# EAGLE design MCP960XL-L0X-RL0X_EVM_v1_Eagle_7.x (EAGLE 7.7.0)
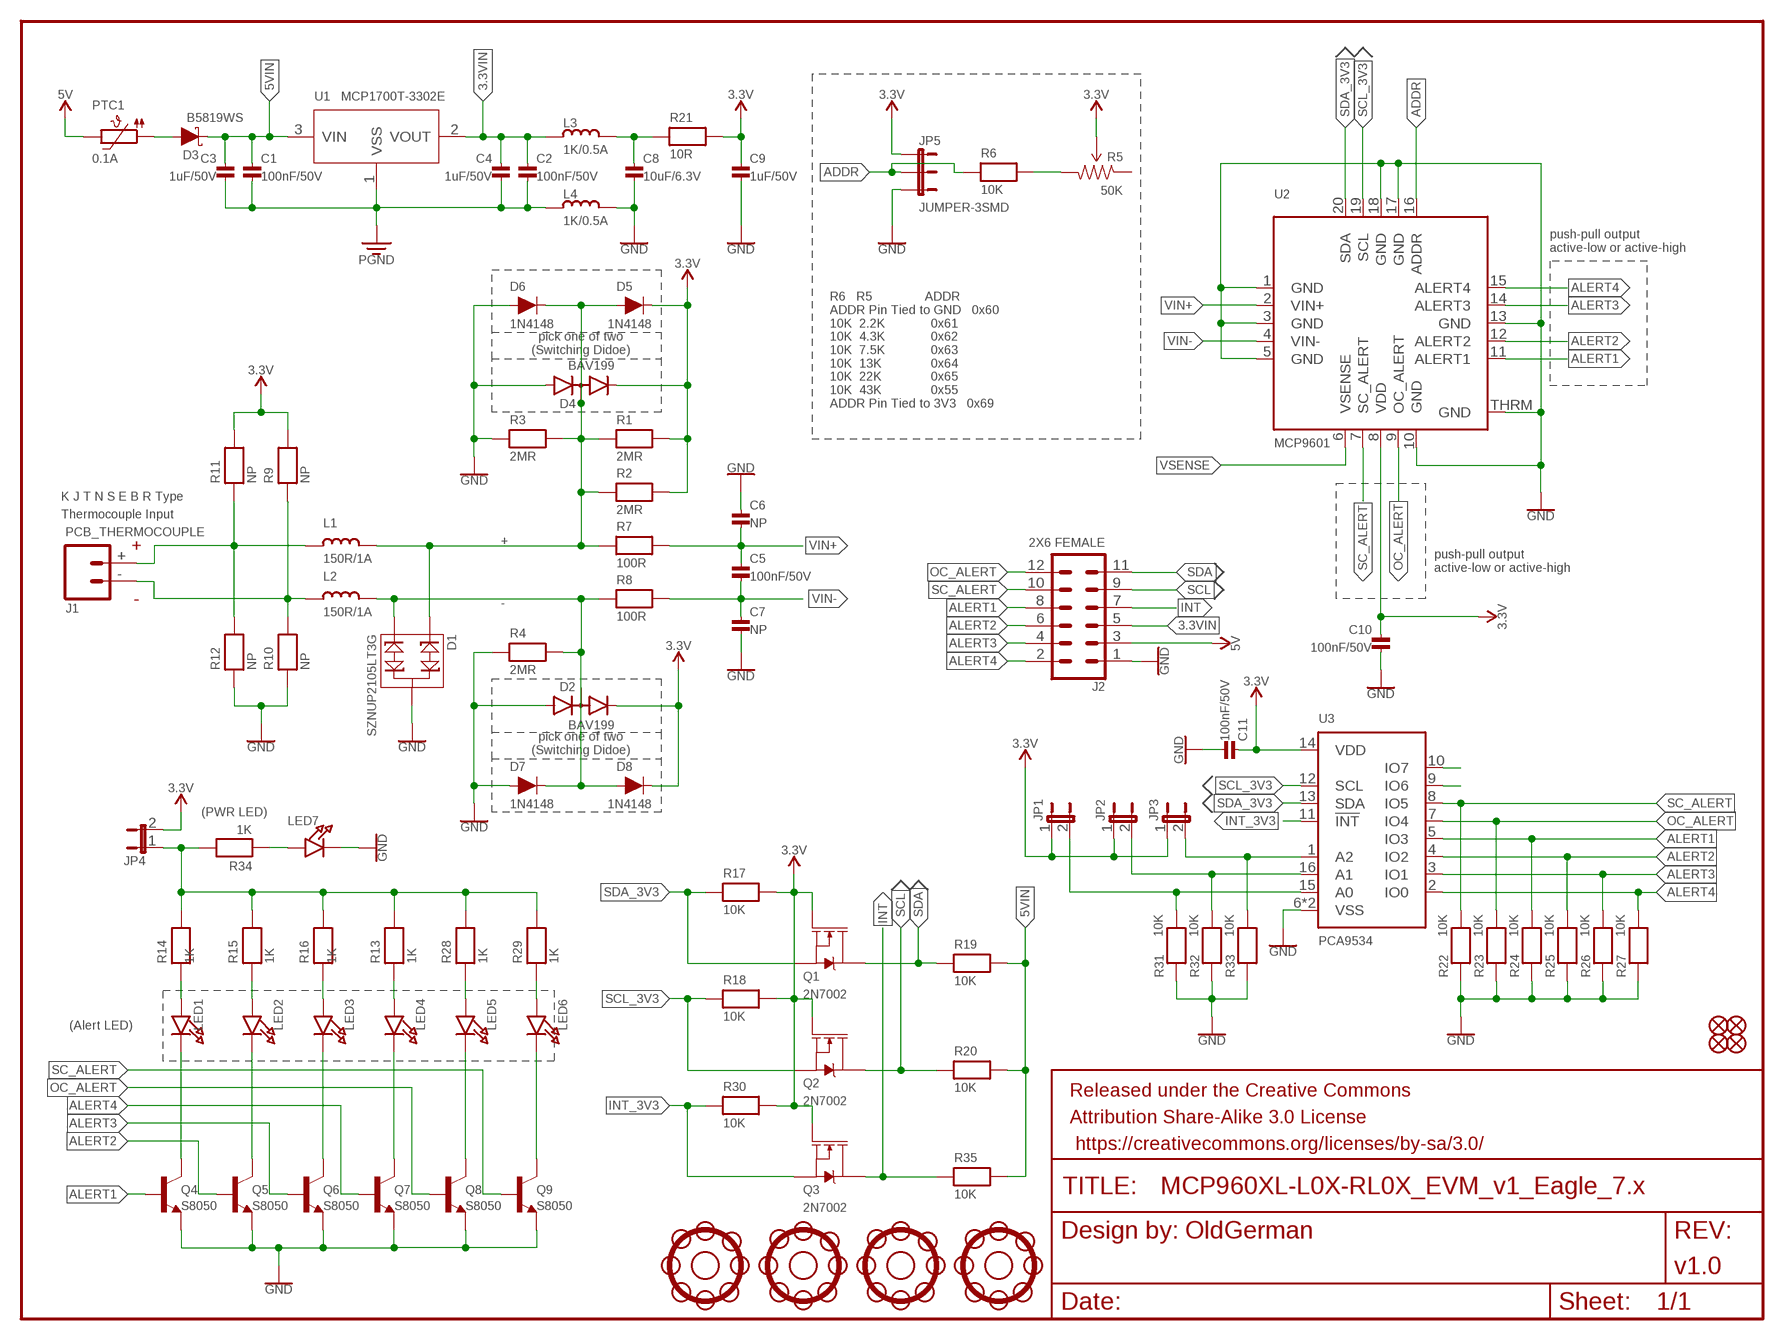
[diagram p0: schematic, sheet 1]

## Parts
C1  100nF/50V  CAP_CERAMIC0603  [0603]
C2  100nF/50V  CAP_CERAMIC0603  [0603]
C3  1uF/50V  CAP_CERAMIC0603  [0603]
C4  1uF/50V  CAP_CERAMIC0603  [0603]
C5  100nF/50V  CAP_CERAMIC0603  [0603]
C6  NP  CAP_CERAMIC0603  [0603]
C7  NP  CAP_CERAMIC0603  [0603]
C8  10uF/6.3V  CAP_CERAMIC0603  [0603]
C9  1uF/50V  CAP_CERAMIC0603  [0603]
C10  100nF/50V  CAP_CERAMIC0603  [0603]
C11  100nF/50V  CAP_CERAMIC0603  [0603]
D1  SZNUP2105LT3G  [SOT23-3]
D2  BAV199  [SOT23-3]
D3  B5819WS  DIODE_SCHOTTKYSOD323  [SOD-323]
D4  BAV199  [SOT23-3]
D5  1N4148  DIODE  [SOD-323]
D6  1N4148  DIODE  [SOD-323]
D7  1N4148  DIODE  [SOD-323]
D8  1N4148  DIODE  [SOD-323]
FID1  FIDUCIAL1X2.5  [FIDUCIAL-1X2.5]
FID2  FIDUCIAL1X2.5  [FIDUCIAL-1X2.5]
FID3  FIDUCIAL1X2.5  [FIDUCIAL-1X2.5]
FID4  FIDUCIAL1X2.5  [FIDUCIAL-1X2.5]
FRAME1  FRAME-LETTER  [CREATIVE_COMMONS]
J1  PCB_THERMOCOUPLE  [PCC-SMP]
J2  2X6 FEMALE  CONN_06X2PTH_FEMALE  [2X6]
JP1  JUMPER-2SMD-NC  [SJ_2S]
JP2  JUMPER-2SMD-NC  [SJ_2S]
JP3  JUMPER-2SMD-NC  [SJ_2S]
JP4  JUMPER-2SMD-NC  [SJ_2S]
JP5  JUMPER-3SMD  [SJ_3]
L1  150R/1A  INDUCTOR0603  [0603]
L2  150R/1A  INDUCTOR0603  [0603]
L3  1K/0.5A  INDUCTOR0603  [0603]
L4  1K/0.5A  INDUCTOR0603  [0603]
LED1  LED0603  [CHIPLED_0603]
LED2  LED0603  [CHIPLED_0603]
LED3  LED0603  [CHIPLED_0603]
LED4  LED0603  [CHIPLED_0603]
LED5  LED0603  [CHIPLED_0603]
LED6  LED0603  [CHIPLED_0603]
LED7  LED0603  [CHIPLED_0603]
PTC1  0.1A  PTC1206  [1206]
Q1  2N7002  MOSFET-NCH-AO3404A  [SOT23-3]
Q2  2N7002  MOSFET-NCH-AO3404A  [SOT23-3]
Q3  2N7002  MOSFET-NCH-AO3404A  [SOT23-3]
Q4  S8050  TRANS_NPN-MMBT2222AL  [SOT23-3]
Q5  S8050  TRANS_NPN-MMBT2222AL  [SOT23-3]
Q6  S8050  TRANS_NPN-MMBT2222AL  [SOT23-3]
Q7  S8050  TRANS_NPN-MMBT2222AL  [SOT23-3]
Q8  S8050  TRANS_NPN-MMBT2222AL  [SOT23-3]
Q9  S8050  TRANS_NPN-MMBT2222AL  [SOT23-3]
R1  2MR  RESISTOR0603  [0603]
R2  2MR  RESISTOR0603  [0603]
R3  2MR  RESISTOR0603  [0603]
R4  2MR  RESISTOR0603  [0603]
R5  50K  POT-SMD  [TRIMPOT-3MM]
R6  10K  RESISTOR0603  [0603]
R7  100R  RESISTOR0603  [0603]
R8  100R  RESISTOR0603  [0603]
R9  NP  RESISTOR0603  [0603]
R10  NP  RESISTOR0603  [0603]
R11  NP  RESISTOR0603  [0603]
R12  NP  RESISTOR0603  [0603]
R13  1K  RESISTOR0603  [0603]
R14  1K  RESISTOR0603  [0603]
R15  1K  RESISTOR0603  [0603]
R16  1K  RESISTOR0603  [0603]
R17  10K  RESISTOR0603  [0603]
R18  10K  RESISTOR0603  [0603]
R19  10K  RESISTOR0603  [0603]
R20  10K  RESISTOR0603  [0603]
R21  10R  RESISTOR0603  [0603]
R22  10K  RESISTOR0603  [0603]
R23  10K  RESISTOR0603  [0603]
R24  10K  RESISTOR0603  [0603]
R25  10K  RESISTOR0603  [0603]
R26  10K  RESISTOR0603  [0603]
R27  10K  RESISTOR0603  [0603]
R28  1K  RESISTOR0603  [0603]
R29  1K  RESISTOR0603  [0603]
R30  10K  RESISTOR0603  [0603]
R31  10K  RESISTOR0603  [0603]
R32  10K  RESISTOR0603  [0603]
R33  10K  RESISTOR0603  [0603]
R34  1K  RESISTOR0603  [0603]
R35  10K  RESISTOR0603  [0603]
U1  MCP1700T-3302E  LDO_3PIN  [SOT23-3]
U2  MCP9601  [VQFN20_5MM]
U3  PCA9534  [HVQFN16_4X4_0.65MM]
U$1  SUN_HOLE_M3  [SUN_HOLE_M3]
U$3  SUN_HOLE_M3  [SUN_HOLE_M3]
U$4  SUN_HOLE_M3  [SUN_HOLE_M3]
U$6  SUN_HOLE_M3  [SUN_HOLE_M3]

## Nets
3.3V: C9.1 C10.1 C11.1 D2.3(C) D4.3(C) D5.C D8.C JP1.1 JP2.1 JP3.1 JP4.2 JP5.1 Q1.1(G) Q2.1(G) Q3.1(G) R1.2 R2.2 R5.2(WIPER) R9.2 R11.2 R17.2 R18.2 R21.2 R30.2 U2.8(VDD) U3.14(VDD)
3.3VIN: C2.1 C4.1 J2.5 L3.1 U1.2(VOUT)
5V: J2.3 PTC1.2
5VIN: C1.1 C3.1 D3.C R19.2 R20.2 R35.2 U1.3(VIN)
A0: JP1.2 R31.2 U3.15(A0)
A1: JP2.2 R32.2 U3.16(A1)
A2: JP3.2 R33.2 U3.1(A2)
ADDR: JP5.2 R6.1 U2.16(ADDR)
ALERT1: J2.8 Q4.1(B) R24.2 U2.11(ALERT1) U3.5(IO3)
ALERT2: J2.6 Q5.1(B) R25.2 U2.12(ALERT2) U3.4(IO2)
ALERT3: J2.4 Q6.1(B) R26.2 U2.14(ALERT3) U3.3(IO1)
ALERT4: J2.2 Q7.1(B) R27.2 U2.15(ALERT4) U3.2(IO0)
GND: C6.1 C7.2 C8.2 C9.2 C10.2 C11.2 D1.3 D2.1(A) D4.1(A) D6.A D7.A J2.1 JP5.3 L4.2 LED7.C Q4.2(E) Q5.2(E) Q6.2(E) Q7.2(E) Q8.2(E) Q9.2(E) R3.1 R4.1 R10.1 R12.1 R22.1 R23.1 R24.1 R25.1 R26.1 R27.1 R31.1 R32.1 R33.1 U2.1(GND) U2.3(GND) U2.5(GND) U2.10(GND) U2.13(GND) U2.17(GND) U2.18(GND) U2.THRM(GND) U3.6(VSS) U3.PAD(VSS)
INT: J2.7 Q3.3(D) R35.1
INT_3V3: Q3.2(S) R30.1 U3.11(!INT)
L1_OUT: D1.1 D4.2(AC) D5.A D6.C L1.2 R1.1 R2.1 R3.2 R7.1
L2_OUT: D1.2 D2.2(AC) D7.C D8.A L2.2 R4.2 R8.1
N$1: R5.1(CW) R6.2
N$2: C8.1 L3.2 R21.1
N$3: LED4.C Q7.3(C)
N$4: LED4.A R13.1
N$5: LED7.A R34.1
N$6: LED5.C Q8.3(C)
N$7: LED1.C Q4.3(C)
N$8: LED5.A R28.1
N$9: LED6.C Q9.3(C)
N$10: LED1.A R14.1
N$14: LED2.C Q5.3(C)
N$15: LED2.A R15.1
N$16: LED3.C Q6.3(C)
N$17: LED3.A R16.1
N$18: LED6.A R29.1
N$19: D3.A PTC1.1
N$20: U3.10(IO7)
N$21: U3.9(IO6)
N$25: JP4.1 R13.2 R14.2 R15.2 R16.2 R28.2 R29.2 R34.2
OC_ALERT: J2.12 Q8.1(B) R23.2 U2.9(OC_ALERT) U3.7(IO4)
PGND: C1.2 C2.2 C3.2 C4.2 L4.1 U1.1(VSS)
SC_ALERT: J2.10 Q9.1(B) R22.2 U2.7(SC_ALERT) U3.8(IO5)
SCL: J2.9 Q2.3(D) R20.1
SCL_3V3: Q2.2(S) R18.1 U2.19(SCL) U3.12(SCL)
SDA: J2.11 Q1.3(D) R19.1
SDA_3V3: Q1.2(S) R17.1 U2.20(SDA) U3.13(SDA)
TH+: J1.+ L1.1 R11.1 R12.2
TH-: J1.- L2.1 R9.1 R10.2
VIN+: C5.1 C6.2 R7.2 U2.2(VIN+)
VIN-: C5.2 C7.1 R8.2 U2.4(VIN-)
VSENSE: U2.6(VSENSE)
Unconnected: J1.CLIP1 J1.CLIP2 R5.3(CCW)

## Notes on the sheet
- push-pull output
  active-low or active-high
- pick one of two
  (Switching Didoe)
- R6   R5               ADDR
  ADDR Pin Tied to GND   0x60
  10K  2.2K             0x61
  10K  4.3K             0x62
  10K  7.5K             0x63
  10K  13K              0x64
  10K  22K              0x65
  10K  43K              0x55
  ADDR Pin Tied to 3V3   0x69
- K J T N S E B R Type
- Thermocouple Input
- +
- push-pull output
  active-low or active-high
- -
- pick one of two
  (Switching Didoe)
- (PWR LED)
- (Alert LED)
- OldGerman
- v1.0

## Library data of the parts
C1-C11 = microbuilder:CAP_CERAMIC: Ceramic Capacitors 0402 - 0402 Surface Mount Capacitors 16pF 50V 5% [Digikey: 445-4899-2-ND] 18pF 50V 5% [Digikey: 490-1281-2-ND] 22pF 50V 5% [Digikey: 490-1283-2-ND] 68pF 50V 5% [Digikey: 490-1289-2-ND] 0.1uF 10V 10% [Digikey: 490-1318-2-ND] 1.0uF 6.3V 10% [Digikey: 490-1320-2-ND] 0603 - 0603 Surface Mount Capacitors 16 pF 50V 5% [Digikey: 445-5051-2-ND] 22 pF 50V [Digikey: PCC220ACVTR-ND] 33 pF 50V 5% [Digikey: 490-1415-1-ND] 56pF 50V 5% [Digikey: 490-1421-1-ND] 220pF 50V 5% [Digikey: 445-1285-1-ND] 680 pF 50V 2200 pF 50V 5% C0G [Digikey: 445-1297-1-ND] 5600 pF 100V 5% X7R [Digikey: 478-3711-1-ND] 0.1 µF 25V 10% [Digikey: PCC2277TR-ND] 0.22 µF 16V 10% X7R [Digikey: 445-1318-1-ND] 1.0 µF 25V 10% [Digikey: 445-5146-2-ND] 0603 - RF Specific 3pF 250V +/-0.1pF RF [Digikey: 712-1347-1-ND] 18 pF 250V 5% [Digikey: 478-3505-1-ND or 712-1322-1-ND] 56 pF 250V 5% C0G RF [Digikey: 490-4867-1-ND] 68 pF 250V RF [Digikey: 490-4868-1-ND] 0805 - 0805 Surface Mount Capacitors 220 pF 250V 2% RF Ceramic Capacitor [Digikey: 712-1398-1-ND] 1000 pF 50V 2% NP0 Ceramic Capacitor [Digikey: 478-3760-1-ND] 0.1 µF 25V 10% Ceramic Capacitor [Digikey: PCC1828TR-ND] 1.0 µF 16V 10% Ceramic Capacitor[Digikey: 490-1691-2-ND] 10.0 µF 10V 10% Ceramic Capacitor[Digikey: 709-1228-1-ND] 10.0 uF 16V 10% Ceramic Capacitor [Digikey: 478-5165-2-ND] 47 uF 6.3V 20% Ceramic Capacitor [Digikey: 587-1779-1-ND or 399-5506-1-ND] 1206 - 1206 Surface Mount Capacitors 47uF 10V 20% Ceramic Capacitor [Digikey: 490-5528-1-ND or 399-5508-1-ND or 445-6010-1-ND] 100uF 6.3V -20%, +80% Y5V Ceramic Capacitor (Digikey: 490-4512-1-ND, Mouser: 81-GRM31CF50J107ZE1L)
D1 = TS100:SZNUP2105LT3G
D2 D4 = TS100:BAV199
D3 = TS100:DIODE_SCHOTTKY
D5-D8 = TS100:DIODE
FID1-FID4 = FUSB302:FIDUCIAL: Fiducial Alignment Points Various fiducial points for machine vision alignment.
FRAME1 = SparkFun-Retired:FRAME-LETTER: Schematic Frame Standard 8.5x11 US Letter frame
J1 = TS100:PCB_THERMOCOUPLE: Circuit Board Thermocouple Connectors Glass-Filled Nylon 220°C (425°F) The PCC connector from OMEGA is perfect for bringing thermocouple probes to printed circuit boards. (OMEGA PCC-SMP) For type-k thermocouples.; PROD_ID: CONN-13075
J2 = SparkFun-Connectors:CONN_06X2: Multi connection point. Often used as Generic Header-pin footprint for 0.1 inch spaced/style header connections On any of the 0.1 inch spaced packages, you can populate with these: Break Away Headers - Straight <https://www.sparkfun.com/products/116> (PRT-00116) Break Away Male Headers - Right Angle <https://www.sparkfun.com/products/553> (PRT-00553) Female Headers <https://www.sparkfun.com/products/115> (PRT-00115) Break Away Headers - Machine Pin <https://www.sparkfun.com/products/117> (PRT-00117) Break Away Female Headers - Swiss Machine Pin <https://www.sparkfun.com/products/743> (PRT-00743); PROD_ID: CONN-12423
JP1-JP4 = SparkFun:JUMPER-2: Jumper Basic 0.1" spaced jumper. Use with breakaway headers.
JP5 = SparkFun-Retired:JUMPER-3
L1-L4 = microbuilder:INDUCTOR: Inductors 0603: 10nH Ceramic Inductor - microwire antenna/RF (Digikey: 712-1434-2-ND) 0805: 560nH Ceramic Inductor - RF (Digikey: 553-1047-1-ND) 270nH Ceramic Inductor - Q = 40@250MHz, +-5%, 1 Ohm DC Resistance (Digikey: 535-10506-2-ND) 1007 (2518 Metric) SMT: 10µH 10% 250mOhm 820mA 1007 Inductor (Digikey: 587-2189-1-ND) 22µH 10% 500mOhm 580mA 1007 Inductor (Digikey: 587-2190-1-ND) 47µH 10% 950mOhm 420mA 1007 Inductor (Digikey: 587-2191-1-ND) 47µH 5% 100mOhm 1A 1008 Inductor (Digikey: 732-1816-1-ND) 5.0x5.0mm (Taiyo Yuden NR5040 Series) 6.8µH 20% 2.3A 64mOhm Inductor (Digikey: 587-2374-2-ND) 5.0x5.0mm (TDK VLC5045 Series) 4.7µH 20% 3.3A 34mOhm Inductor (Digikey: 445-6526-1-ND) 6.8µH 20% 2.7A 46mOhm Inductor (Digikey: 445-6527-1-ND) 6.0x6.0mm (TDK VLC6045 Series) 4.7µH 20% 3.8A 27mOhm Inductor (Digikey: 445-6538-2-ND) 6.8µH 20% 3A 41mOhm Inductor (Digikey: 445-6540-1-ND) 6.2µH 30% 2.2A 45mOhm Inductor (Digikey: SRR5028-6R2YCT-ND) - Not TDK VLC6045 but footprint should match 6.0x6.0mm (TDK SLF6045 Series) 6.8uH 30% 2A 33mOhm Inductor (Digikey: 445-4572-1-ND, Mouser: 810-SLF645T6R8N2R0PF)
LED1-LED7 = microbuilder:LED: LED 0603 - 0603 Surface Mount Package 2mA: Green LED - Low Power (3.9mcd, 2ma, 1.7Vf) - Digikey: 475-2709-2-ND Orange LED - Low Power (9.8mcd, 2ma, 1.8Vf) - Digikey: 475-1194-2-ND Red LED - Low Power (5mcd, 2ma, 1.8Vf) - Digikey: 475-1195-2-ND Yellow LED - Low Power (7mcd, 2ma, 1.8Vf) - Digikey: 475-1196-2-ND 5mA: Blue LED - Low Power (17mcd, 5ma, 2.9Vf) - Digikey: LNJ937W8CRACT-ND 0805 - 0805 Surface Mount Package 2mA: Red LED (8.8mcd, 2mA, 1.8Vf, Clear) - Low Power [Digikey: 475-2510-1-ND] Green LED (5mcd, 2mA, 1.8Vf, Clear) - Low Power [Digikey: 475-2730-1-ND] Yellow LED (11.3mcd, 2mA, 1.8Vf, Clear) - Low Power [Digikey: 475-2555-1-ND] 20mA: Red LED (104mcd, 20mA, Diffused) - LS R976 [Digikey: 475-1278-6-ND] Red LED (12mcd, 20mA, 2.0Vf, Clear) - APT2012EC [Digikey: 754-1128-1-ND] Green LED (15mcd, 20mA, 2.2Vf, Clear) - APT2012GC [Digikey: 754-1131-1-ND] Orange LED (160mcd, 20mA, 2.1Vf, Clear) - APT2012SECK [Digikey: 754-1130-1-ND] 1206 - 1206 Surface Mount Package Green LED (26mcd, 20mA, Diffused) - LG N971 [Digikey: 475-1407-6-ND] Red LED (15mcd, 20mA, Diffused) - LH N974 [Digikey: 475-1416-6-ND]
PTC1 = microbuilder:PTC: PTC (Resettable Fuse) 1206 Package 250mA PTC (16V Max, Time-to-Trip: 0.08s) - Digikey: F2110CT-ND 1210 Package 100mA PTC (30V Max, Time-to-Trip: 0.6s) - Digikey: MF-USMF010-2CT-ND 1812 Package 750mA PTC (24V Max, Time-to-Trip: 0.2s) - Digikey: MF-MSMF075/24-2CT-ND
Q1-Q3 = SparkFun-DiscreteSemi:MOSFET-NCH: N-channel MOSFETs Voltage controlled devices that allow control of high current outputs. SparkFun Products: SparkFun OpenScale <https://www.sparkfun.com/products/13261> SparkFun Digital Sandbox <https://www.sparkfun.com/products/12651> SparkFun Monster Moto Shield <https://www.sparkfun.com/products/10182> SparkFun MOSFET Power Controller <https://www.sparkfun.com/products/11214>; PROD_ID: TRANS-12988; VALUE: 5.8A/30V/35mΩ
Q4-Q9 = SparkFun-DiscreteSemi:TRANS_NPN: NPN transistor Current controlled devices typically used to amplify current or used as a switch. BC547 - COM-08928 <http://www.sparkfun.com/products/8928> (TO-92 45V 100mA) (1.Collector 2.Base 3.Emitter) 2N3904 - COM-00521 <http://www.sparkfun.com/products/521> (TO-92 40V 200mA) (1.Emitter 2.Base 3.Collector) P2N2222A - COM-12852 <http://www.sparkfun.com/products/12852> (TO-92 40V 600mA) (1.Collector 2.Base 3.Emitter); PROD_ID: TRANS-08049; VALUE: 600mA/40V
R1-R4 R6-R35 = microbuilder:RESISTOR: Resistors 0402 - 0402 Surface Mount Package 22 Ohm 1% 1/16W [Digikey: 311-22.0LRTR-ND] 33 Ohm 5% 1/16W 1.0K 5% 1/16W 1.5K 5% 1/16W 2.0K 1% 1/16W 10.0K 1% 1/16W [Digikey: 311-10.0KLRTR-ND] 10.0K 5% 1/16W [Digikey: RMCF0402JT10K0TR-ND] 12.1K 1% 1/16W [Digikey: 311-22.0LRTR-ND] 100.0K 5% 1/16W 0603 - 0603 Surface Mount Package 0 Ohm 1/10 Watt 1% Resistor 15 Ohm 1/10 Watt 1% Resistor 33 Ohm 1/10 Watt 1% Resistor 49.9 Ohm 1/10 Watt 1% Resistor 100 Ohm 1/10 Watt 1% Resistor 150 Ohm 1/10 Watt 1% Resistor 240 Ohm 1/10 Watt 1% Resistor 390 Ohm 1/10 Watt 1% Resistor 560 Ohm 1/10 Watt 1% Resistor 680 Ohm 1/10 Watt 1% Resistor 750 Ohm 1/10 Watt 1% Resistor 1.0K Ohm 1/10 Watt 1% Resistor 1.5K Ohm 1/10 Watt 1% Resistor 2.0K Ohm 1/10 Watt 1% Resistor 2.2K Ohm 1/10 Watt 1% Resistor 3.3K Ohm 1/10 Watt 1% Resistor 4.7K Ohm 1/10 Watt 1% Resistor 10.0K Ohm 1/10 Watt 1% Resistor 12.0K Ohm 1/10 Watt 1% Resistor 12.1K Ohm 1/10 Watt 1% Resistor 20.0K Ohm 1/10 Watt 1% Resistor 33.0K Ohm 1/10 Watt 1% Resistor 100.0K Ohm 1/10 Watt 1% Resistor 0805 - 0805 Surface Mount Package 0 Ohm 1/8 Watt 1% Resistor 33 Ohm 1/8 Watt 1% Resistor 100 Ohm 1/8 Watt 1% Resistor 150 Ohm 1/8 Watt 1% Resistor 200 Ohm 1/8 Watt 1% Resistor 240 Ohm 1/8 Watt 1% Resistor 330 Ohm 1/8 Watt 1% Resistor 390 Ohm 1/8 Watt 1% Resistor 470 Ohm 1/8 Watt 1% Resistor 1.0K Ohm 1/8 Watt 1% Resistor 1.5K Ohm 1/8 Watt 1% Resistor 2.0K Ohm 1/8 Watt 1% Resistor 4.7K Ohm 1/8 Watt 1% Resistor 5.1K Ohm 1/8 Watt 1% Resistor 5.6K Ohm 1/8 Watt 1% Resistor 10.0K Ohm 1/8 Watt 1% Resistor 22.0K Ohm 1/8 Watt 1% Resistor 33.0K Ohm 1/8 Watt 1% Resistor 100K Ohm 1/8 Watt 1% Resistor 1206 - 1206 Surface Mount Package 2012 - 2010 Surface Mount Package 0.11 Ohm 1/2 Watt 1% Resistor - Digikey: RHM.11UCT-ND
R5 = TS100:POT: Various small potentiometers for "set-and-forget" applications; PROD_ID: RES-08048; VALUE: 10k
U1 = TS100:LDO_3PIN
U2 = TS100:MCP9601
U3 = TS100:PCA9534
U$1 U$3 U$4 U$6 = FUSB302:SUN_HOLE_M3

## Board
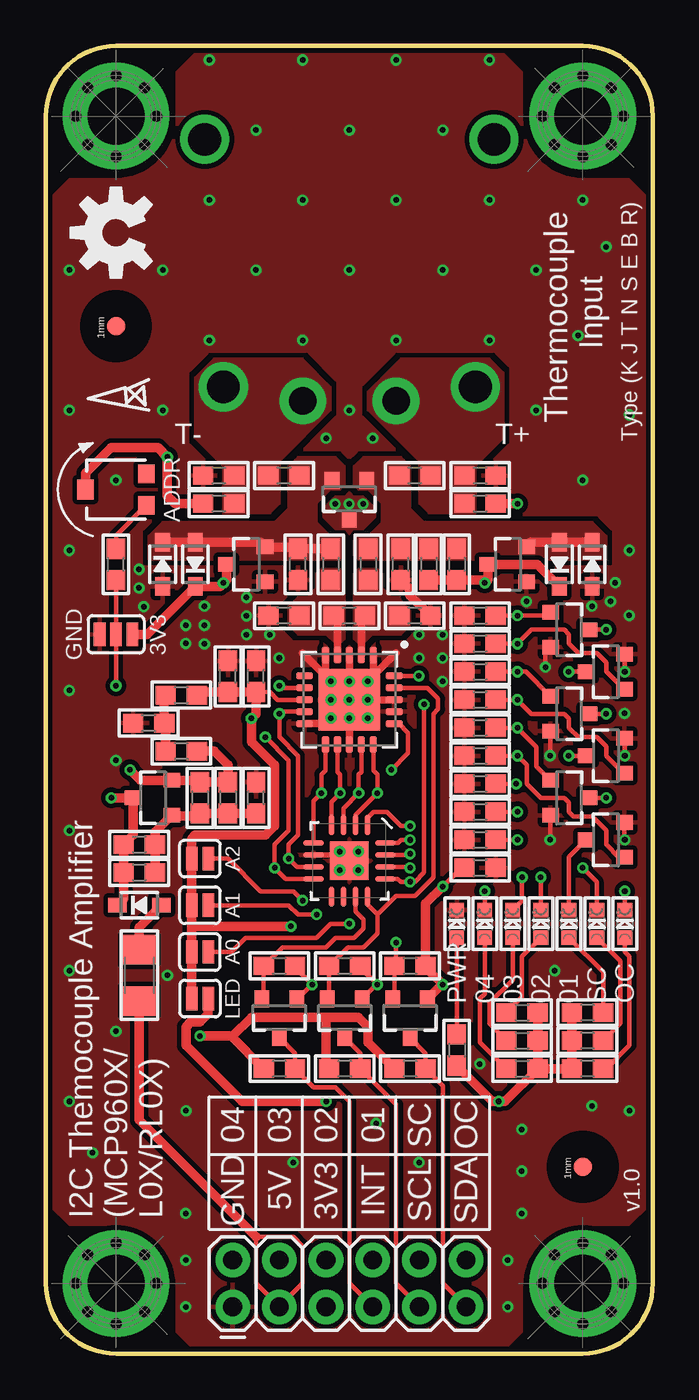
[diagram p1: board, top side]
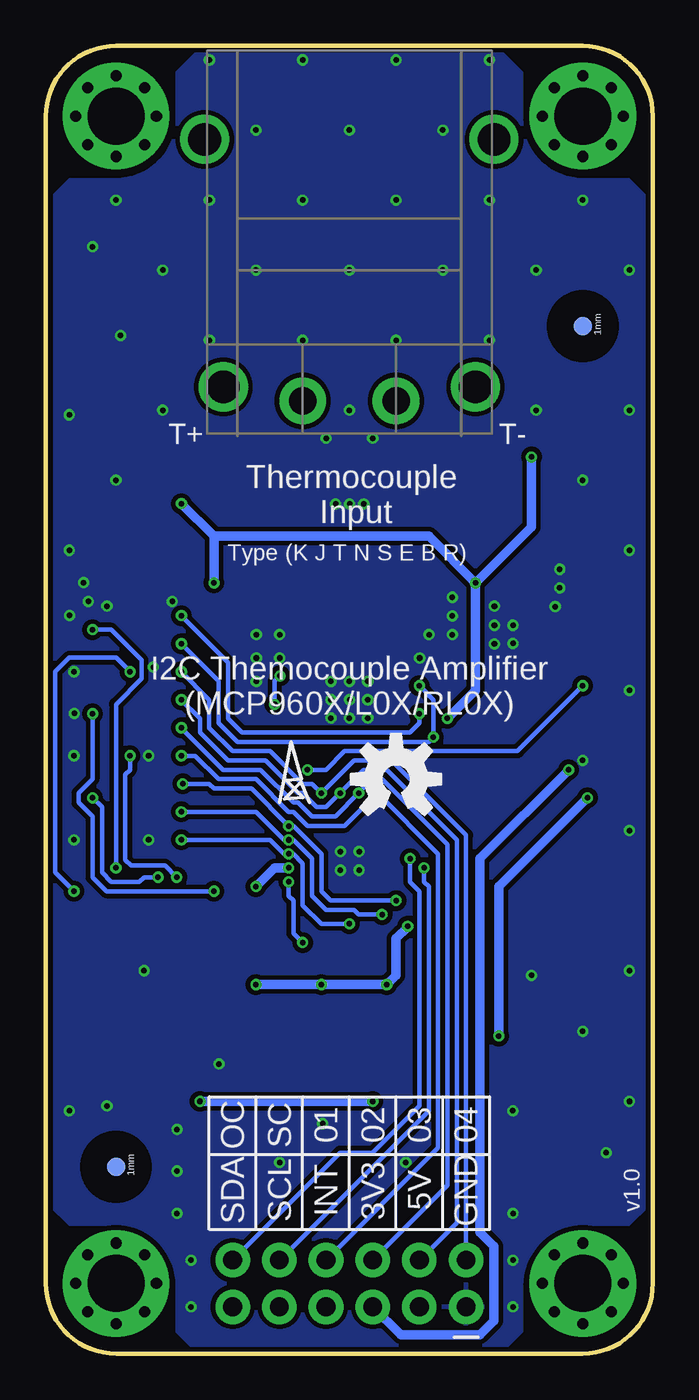
[diagram p2: board, bottom side, seen from below]

Size 33.02 x 71.12 mm. Coordinates in mm from the lower left corner, seen from the top.
Outline: 3.81,71.12 29.21,71.12 arc-90 33.02,67.31 33.02,3.81 arc-90 29.21,0 3.81,0 arc-90 0,3.81 0,67.31 arc-90 3.81,71.12
Copper layers (1*16): Top 0.035mm / dielectric 1.5mm / Bottom 0.035mm
Design rules "SeeedStudio_2layer_DRU_no_angle_20140221 *": minimum track width 10mil, minimum drill 10mil, track to track 10mil, track to pad 6mil, pad to pad 6mil, via to via 6mil, smd to smd 0mil, copper to edge 10mil, drill to drill 10mil, minimum pad ring 10mil, minimum via ring 6mil, stop-mask expansion 2mil, vias tented up to drill 100mil, thermal gap 10mil
tRestrict: area -0.6,-0.8 to 8.3,8.1; area 24.8,-0.8 to 33.7,8.1; area -0.6,62.7 to 8.3,71.6; area 24.8,62.7 to 33.7,71.6
bRestrict: area 24.8,-0.8 to 33.7,8.1; area -0.6,-0.8 to 8.3,8.1; area 24.8,62.7 to 33.7,71.6; area -0.6,62.7 to 8.3,71.6

### Footprints (pad centres in the part's own frame; a part is rotated, then mirrored left to right if it is on the bottom)
0603 = smd 1.1 x 1: 1 -0.85,0; 2 0.85,0
SOT23-3 = smd 0.8 x 0.9: 1 -0.95,-1; 2 0.95,-1; 3 0,1.1
SOD-323 = smd 1 x 0.8: A 1.2,0; C -1.2,0
FIDUCIAL-1X2.5 = smd 1 x 1: 1 0,0
PCC-SMP = drill 1.778: + 6.858,0; - -6.858,0; CLIP1 -7.874,-13.462; CLIP2 7.874,-13.462
2X6 = drill 1.016 pad 1.88: 1 0,0; 2 0,2.54; 3 2.54,0; 4 2.54,2.54; 5 5.08,0; 6 5.08,2.54; 7 7.62,0; 8 7.62,2.54; 9 10.16,0; 10 10.16,2.54; 11 12.7,0; 12 12.7,2.54
SJ_2S = smd 0.635 x 1.27: 1 -0.447,0; 2 0.447,0
SJ_3 = smd 0.635 x 1.27: 1 -0.889,0; 2 0,0; 3 0.889,0
CHIPLED_0603 = smd 0.8 x 0.8: A 0,-0.75; C 0,0.75
1206 = smd 1.6 x 1.8: 1 -1.4,0; 2 1.4,0
TRIMPOT-3MM = smd 1 x 0.9: 1 -0.85,-1.65; 3 0.85,-1.65 | smd 1.1 x 0.9: 2 0,1.65
VQFN20_5MM = smd 0.925 x 0.4: 1 -2.438,1.3; 2 -2.438,0.65; 3 -2.438,0; 4 -2.438,-0.65; 5 -2.438,-1.3; 11 2.438,-1.3; 12 2.438,-0.65; 13 2.438,0; 14 2.438,0.65; 15 2.438,1.3 | smd 0.4 x 0.925: 6 -1.3,-2.438; 7 -0.65,-2.438; 8 0,-2.438; 9 0.65,-2.438; 10 1.3,-2.438; 16 1.3,2.438; 17 0.65,2.438; 18 0,2.438; 19 -0.65,2.438; 20 -1.3,2.438 | smd 3.35 x 3.35: THRM 0,0
HVQFN16_4X4_0.65MM = smd 1.1 x 0.3: 1 -1.95,0.975; 2 -1.95,0.325; 3 -1.95,-0.325; 4 -1.95,-0.975; 9 1.95,-0.975; 10 1.95,-0.325; 11 1.95,0.325; 12 1.95,0.975 | smd 0.3 x 1.1: 5 -0.975,-1.95; 6 -0.325,-1.95; 7 0.325,-1.95; 8 0.975,-1.95; 13 0.975,1.95; 14 0.325,1.95; 15 -0.325,1.95; 16 -0.975,1.95 | smd 2.1 x 2.1: PAD 0,0
SUN_HOLE_M3 = drill 3.1 pad 5.8: P$1 0,0 | drill 0.6 pad 1: P$2 0,2.2; P$3 0,-2.2; P$4 -2.2,0; P$5 2.2,0; P$6 1.55,1.55; P$7 1.55,-1.55; P$8 -1.55,1.55; P$9 -1.55,-1.55

### Placement (x,y rotation side)
C1  5.08,27.69 0 top
C2  9.91,30.23 270 top
C3  5.08,26.16 0 top
C4  8.38,30.23 270 top
C5  16.51,40.13 180 top
C6  20.07,40.13 180 top
C7  12.95,40.13 180 top
C8  5.59,34.29 180 top
C9  9.91,36.83 90 top
C10  11.43,36.83 90 top
C11  23.62,26.42 0 top
D1  16.51,46.48 180 top
D2  10.92,42.93 90 top
D3  5.08,24.38 0 top
D4  25.15,42.93 90 top
D5  27.94,42.93 90 top
D6  29.72,42.93 270 top
D7  6.35,42.93 270 top
D8  8.13,42.93 90 top
FID1  3.81,55.88 270 top
FID2  29.21,10.16 270 top
FID3  29.21,10.16 90 bottom
FID4  3.81,55.88 90 bottom
FRAME1  -6.6,-19.81 0 top  (outside the outline)
J1  16.51,52.58 180 bottom
J2  10.16,2.54 0 top
JP1  8.38,21.84 0 top
JP2  8.38,24.38 0 top
JP3  8.38,26.92 0 top
JP4  8.38,19.3 180 top
JP5  3.81,39.12 180 top
L1  20.07,47.75 180 top
L2  12.95,47.75 0 top
L3  7.37,32.77 180 top
L4  11.43,30.23 90 top
LED1  28.45,23.37 0 top
LED2  26.92,23.37 0 top
LED3  25.4,23.37 0 top
LED4  23.88,23.37 0 top
LED5  29.97,23.37 0 top
LED6  31.5,23.37 0 top
LED7  22.35,23.37 0 top
PTC1  5.08,20.57 270 top
Q1  19.81,18.29 180 top
Q2  16.26,18.29 180 top
Q3  12.7,18.29 180 top
Q4  30.48,27.94 90 top
Q5  28.45,30.23 270 top
Q6  30.48,32.51 90 top
Q7  28.45,34.8 270 top
Q8  28.45,39.37 270 top
Q9  30.48,37.08 90 top
R1  20.83,42.93 270 top
R2  22.35,42.93 270 top
R3  19.3,42.93 90 top
R4  13.72,42.93 90 top
R5  3.81,46.99 90 top
R6  3.81,42.93 90 top
R7  17.53,42.93 270 top
R8  15.49,42.93 270 top
R9  9.4,46.23 180 top
R10  9.4,47.75 0 top
R11  23.62,46.23 0 top
R12  23.62,47.75 180 top
R13  25.91,15.49 0 top
R14  29.46,18.54 180 top
R15  25.91,18.54 0 top
R16  25.91,17.02 0 top
R17  19.81,21.08 0 top
R18  16.26,21.08 0 top
R19  19.81,15.49 180 top
R20  16.26,15.49 180 top
R21  7.37,35.81 0 top
R22  23.62,38.61 0 top
R23  23.62,40.13 0 top
R24  23.62,32.51 0 top
R25  23.62,34.04 0 top
R26  23.62,35.56 0 top
R27  23.62,37.08 0 top
R28  29.46,17.02 180 top
R29  29.46,15.49 180 top
R30  12.7,21.08 0 top
R31  23.62,27.94 0 top
R32  23.62,29.46 0 top
R33  23.62,30.99 0 top
R34  22.35,16.51 270 top
R35  12.7,15.49 180 top
U1  5.84,30.23 90 top
U2  16.51,35.56 270 top
U3  16.51,26.8 270 top
U$1  29.21,67.31 90 top
U$2  [OSHW-LOGO-M]  13.97,31.24 0 bottom
U$3  29.21,3.81 90 top
U$4  3.81,3.81 90 top
U$5  [OSHW-LOGO-M]  3.81,60.96 90 top
U$6  3.81,67.31 90 top

### Tracks (layer width: path | path; a pad name or v marks a point on that pad's centre or on a via)
3.3V  (via drill 0.3)
  Top 0.254: 13.65,20.98 R30.2 13.55,20.99 v14.48,20.07 13.7,19.29 Q3.1 | R18.2 17.21,20.98 17.21,20.89 v18.03,20.07 17.98,20.07 Q2.1 | R17.2 20.76,20.98 | C10.1 12.19,35.98 12.61,35.56 U2.8 | U3.14 19.76,26.47 v19.81,26.42 | C11.1 22.61,26.42 v21.59,25.4
  Top 0.508: R21.2 8.38,35.98 C9.1 C10.1 11.43,34.8 v11.18,34.54 11.18,33.27 12.45,32 12.45,28.7 11.94,28.19 8.13,28.19 7.94,28 JP3.1 JP2.1 7.94,23.24 | D5.C 26.74,42.93 D4.3 24.05,42.08 v23.88,41.91 23.71,42.08 R2.2 R1.2 | R11.2 v25.65,46.23 | D2.3 9.82,42.08 v9.65,41.91 9.47,41.73 D8.C 5.52,39.12 JP5.1 | R9.2 7.02,46.23 6.6,46.65 v6.6,48.77 6.1,49.28 3.56,49.28 2.16,47.88 R5.2 | 7.94,23.24 JP1.1 JP4.2 | v13.34,23.24 7.94,23.24 | Q1.1 20.81,19.29 | Q1.1 20.66,19.39 | v21.59,25.4 20.66,24.47 R17.2 20.66,20.99 v21.59,20.07 21.54,20.07 Q1.1
  Bottom 0.508: v25.65,46.23 23.88,44.45 | v6.6,48.77 6.6,44.96 v9.65,41.91 | v11.18,34.54 9.65,36.07 v9.65,41.91 | v21.59,20.07 v18.03,20.07 v14.48,20.07 13.97,20.57 13.97,22.58 13.34,23.21 v13.34,23.24 | v21.59,25.4 20.57,26.42 v19.81,26.42 | v23.88,41.91 23.88,44.45 | 23.88,44.45 12.19,44.45 v9.65,41.91
3.3VIN  (via drill 0.3)
  Top 0.508: L3.1 9.14,32.77 9.91,32 C2.1 C4.1 8.28,31.18 U1.2 5.15,31.18 v4.57,31.75
  Bottom 0.508: v4.57,31.75 9.4,26.92 9.4,6.6 8.64,5.84 8.64,1.78 9.4,1.02 13.72,1.02 J2.5
5V
  Top 0.254: J2.3 13.97,3.81 13.97,5.84 13.46,6.35 11.43,6.35 11.43,3.81 J2.3
  Top 0.508: PTC1.2 5.08,12.7 11.43,6.35
5VIN  (via drill 0.3)
  Top 0.508: R19.2 17.53,16.93 17.53,17.78 17.02,18.29 15.24,18.29 | 15.24,18.29 11.18,18.29 10.16,17.27 10.07,17.27 | R20.2 15.24,15.66 15.24,18.29 | R35.2 10.07,17.27 | v3.56,30.23 U1.3 4.74,28.19 C1.1 C3.1 4.23,24.73 D3.C | v8.38,17.27 10.07,17.27
  Bottom 0.508: v8.38,17.27 8.38,25.4 v3.56,30.23
A0  (via drill 0.3)
  Top 0.254: U3.15 19.76,27.12 v19.81,27.18 | R31.2 v25.65,27.94 | v16.51,23.37 15.49,23.37 14.73,22.61 10.86,22.61 10.1,21.84 JP1.2
  Bottom 0.254: v25.65,27.94 20.83,27.94 20.07,27.18 v19.81,27.18 19.56,27.18 19.05,26.67 19.05,24.38 18.03,23.37 v16.51,23.37
A1  (via drill 0.3)
  Top 0.254: U3.16 19.14,27.77 19.3,27.94 v19.81,27.94 | R32.2 v25.65,29.46 | v14.73,23.88 13.72,23.88 13.21,24.38 JP2.2
  Bottom 0.254: v25.65,29.46 21.59,29.46 20.06,27.94 v19.81,27.94 19.55,27.94 18.54,26.92 18.54,24.89 17.78,24.13 16.26,24.13 16,23.88 v14.73,23.88
A2  (via drill 0.3)
  Top 0.254: v19.81,28.69 19.3,28.69 18.54,29.45 17.81,29.45 17.49,29.13 U3.1 | R33.2 v25.58,30.99 | v13.97,24.64 13.46,25.15 11.68,25.15 9.91,26.92 JP3.2
  Bottom 0.254: v25.58,30.99 24.13,30.99 23.88,30.73 21.84,30.73 19.81,28.7 v19.81,28.69 19.55,28.69 18.03,27.18 18.03,25.15 17.53,24.64 v13.97,24.64
ADDR  (via drill 0.3)
  Top 0.254: v18.8,31.75 19.71,32.66 19.71,33.75 19.2,34.26 U2.16 | v3.81,36.32 JP5.2 R6.1
  Bottom 0.254: v3.81,36.32 7.37,32.77 16.76,32.77 17.78,31.75 v18.8,31.75
ALERT1  (via drill 0.3)
  Top 0.254: U2.11 15.21,31.72 14.99,31.5 v14.99,30.48 14.56,30.05 U3.5 | R24.2 v25.65,32.51 26.16,32 26.16,30.99 26.92,30.23 28.19,30.23 28.45,29.97 28.45,29.46 28.7,29.21 29.72,29.21 30.48,28.45 30.48,27.69 31.18,26.99 Q4.1
  Bottom 0.254: v25.65,32.51 24.89,32.51 23.62,31.24 21.59,31.24 19.81,29.46 19.56,29.46 18.8,28.7 16.76,28.7 v14.99,30.48 11.68,27.18 11.68,11.18 J2.8
ALERT2  (via drill 0.3)
  Top 0.254: U2.12 15.86,31.64 16,31.5 v16,30.48 15.54,30.01 U3.4 | R25.2 v25.65,34.04 26.69,33 26.69,31.94 Q5.1
  Bottom 0.254: v25.65,34.04 23.37,31.75 21.34,31.75 19.56,29.97 19.3,29.97 18.54,29.21 17.27,29.21 v16,30.48 15.24,31.24 14.73,31.24 11.18,27.69 11.18,9.14 J2.6
ALERT3  (via drill 0.3)
  Top 0.254: U2.14 17.16,31.64 17.02,31.5 v17.02,30.48 16.19,29.65 U3.3 | R26.2 v25.65,35.56 26.42,34.8 28.19,34.8 28.45,34.54 28.45,34.04 28.96,33.53 29.97,33.53 30.48,33.02 30.48,32.51 31.43,31.56 Q6.1
  Bottom 0.254: v25.65,35.56 24.64,34.54 24.64,33.78 23.11,32.26 21.08,32.26 19.3,30.48 19.05,30.48 18.29,29.72 17.78,29.72 v17.02,30.48 15.75,31.75 14.48,31.75 10.67,27.94 10.67,7.11 J2.4
ALERT4  (via drill 0.3)
  Top 0.254: U2.15 17.81,31.72 18.03,31.5 v18.03,30.48 16.84,29.28 U3.2 | R27.2 v25.65,37.08 26.11,37.08 Q7.1
  Bottom 0.254: v25.65,37.08 24.13,35.56 24.13,34.04 22.86,32.77 20.83,32.77 19.05,30.99 18.54,30.99 v18.03,30.48 16.26,32.26 14.22,32.26 10.16,28.19 J2.2
GND  (via drill 0.3)
  Top 0.254: Q8.2 27.18,38.15 v27.18,37.34 | Q7.2 27.45,32.53 v27.43,32.51 | Q5.2 27.45,27.96 v27.43,27.94 | Q9.2 31.5,38.02 v31.5,37.08 | Q6.2 31.5,33.45 v31.5,32.51 | Q4.2 31.48,27.96 v31.5,27.94 | 22.35,27.52 R31.1
  Top 0.3: U3.6 15.8,27.12 v15.99,27.3
  Top 0.4: U2.13 16.51,35.31 | 16.51,35.31 U2.THRM | U2.5 15.21,36.1 16,35.31 16.51,35.31 | U2.1 17.81,36.61 16.51,35.31 | U2.3 U2.THRM | U2.10 15.21,34.26 v15.51,34.56 | U2.18 v17.51,35.56 | U2.THRM 19.05,38.1 | U2.THRM 13.97,38.1
  Top 0.508: R3.1 19.81,41.57 19.81,41.24 C6.1 | U3.PAD 17,26.3 v17,26.29
  other vias: 16.51,36.56 17.51,36.56 15.51,36.56 15.51,35.56 16.51,34.56 17.51,34.56 16.49,35.56 15.99,26.29 17,27.3 17.26,46.21 16.49,46.21 15.73,46.21 31.73,40.15 13.45,10.4 20.3,10.4 5.32,40.62 23.61,15.75 25.89,12.19 29.7,13.46 25.89,7.62 25.13,2.54 7.6,7.62 12.68,37.83 10.91,39.1 10.91,40.12 10.91,41.13 8.62,39.61 8.62,38.59 12.18,39.1 7.6,39.61 20.3,37.83 20.3,39.1 21.57,39.1 21.57,37.83 30.48,60.2 1.27,51.31 15.24,49.78 16.51,51.31 11.43,58.93 16.51,58.93 13.97,55.12 19.05,55.12 21.59,58.93 8.89,55.12 6.35,58.93 8.89,62.74 13.97,62.74 11.43,66.55 19.05,62.74 16.51,66.55 21.59,66.55 24.13,62.74 13.97,70.36 19.05,70.36 8.89,70.36 24.13,70.36 26.67,58.93 29.21,62.74 3.81,62.74 3.81,47.5 1.27,58.93 6.35,51.31 24.13,55.12 28.96,55.37 26.67,51.31 29.21,47.5 17.78,49.78 21.57,36.56 31.75,51.05 1.27,43.69 1.27,36.07 1.27,28.45 1.27,20.83 1.27,13.72 3.81,32.26 3.81,17.53 2.54,10.92 7.62,13.21 31.75,43.69 31.75,13.21 25.89,9.92 25.13,5.08 7.6,5.08 7.6,2.54 6.6,20.57 31.48,34.81 7.6,38.62 27.69,20.83 5.06,41.64 5.06,42.66 29.7,40.66 30.72,40.91 30.97,41.93 26.15,40.91 8.62,40.66 17.97,12.51
  pour Top (rank 6): 34.29,72.39 34.29,-1.27 -1.27,-1.27 -1.27,72.39
  pour Bottom (rank 6): 34.29,72.39 34.29,-1.27 -1.27,-1.27 -1.27,72.39
  pour Top (isolate 0.254, rank 2, no thermals): 14.99,46.86 14.99,44.7 18.03,44.7 18.03,46.86
INT
  Top 0.254: J2.7 16.51,3.81 16.51,13.72 15.75,14.48 14.57,14.48 R35.1 13.55,16.34 Q3.3
INT_3V3
  Top 0.254: Q3.2 11.85,19.39 R30.1 12.87,22.1 15.24,22.1 15.75,22.61 16.76,22.61 17.27,23.11 17.27,23.62 16.84,24.06 U3.11
L1_OUT
  Top 0.508: D4.2 26.4,44.13 D5.A D6.C
  pour Top (no thermals): 19.81,48.26 19.81,45.97 20.57,45.21 29.72,45.21 30.48,44.45 30.48,43.18 17.02,43.18 16.76,43.43 16.76,44.2 17.02,44.45 17.53,44.45 18.29,45.21 18.29,46.23 17.53,46.99 17.02,46.99 16.76,47.24 16.76,48.26 17.27,48.77 19.3,48.77
L2_OUT
  Top 0.508: R8.1 R4.2 13.62,43.88 D2.2 11.67,44.13 D8.A D7.C
  pour Top (no thermals): 13.21,48.26 13.21,45.97 12.45,45.21 6.35,45.21 5.59,44.45 5.59,43.18 16,43.18 16.26,43.43 16.26,44.2 16,44.45 15.49,44.45 14.73,45.21 14.73,46.23 15.49,46.99 16,46.99 16.26,47.24 16.26,48.26 15.75,48.77 13.72,48.77
N$1
  Top 0.254: R6.2 3.81,44.49 R5.1
N$2
  Top 0.508: L3.2 6.52,34.21 C8.1 6.44,35.74 R21.1
N$3  (via drill 0.3)
  Top 0.254: v30.48,34.8 Q7.3 | v23.88,25.15 LED4.C
  Bottom 0.254: v30.48,34.8 30.48,31.24 31.24,30.48 31.24,29.97 30.48,29.21 30.48,25.91 29.72,25.15 v23.88,25.15
N$4
  Top 0.254: LED4.A 23.88,19.57 23.62,19.32 23.62,16.93 R13.1
N$5
  Top 0.254: R34.1 LED7.A
N$6  (via drill 0.3)
  Top 0.254: v29.21,26.42 29.97,25.65 LED5.C | v30.48,39.37 Q8.3
  Bottom 0.254: v30.48,39.37 29.46,39.37 27.81,37.72 27.81,36.7 29.21,35.31 v29.21,26.42
N$7
  Top 0.254: Q4.3 28.45,27.01 LED1.C
N$8
  Top 0.254: LED5.A 31.24,21.35 31.24,17.95 R28.1
N$9  (via drill 0.3)
  Top 0.254: Q9.3 v28.45,37.08 | v31.5,25.15 LED6.C
  Bottom 0.254: v28.45,37.08 29.21,37.85 31.75,37.85 32.51,37.08 32.51,26.16 v31.5,25.15
N$10
  Top 0.254: LED1.A 30.31,20.75 R14.1
N$14  (via drill 0.3)
  Top 0.254: v30.48,30.23 Q5.3 | v26.92,25.91 LED2.C
  Bottom 0.254: v30.48,30.23 29.97,29.72 29.97,26.16 29.46,25.65 27.94,25.65 27.69,25.91 v26.92,25.91
N$15
  Top 0.254: LED2.A 25.91,21.6 25.91,19.39 R15.1
N$16  (via drill 0.3)
  Top 0.254: v28.45,32.51 Q6.3 | v25.91,25.91 25.91,24.63 LED3.C
  Bottom 0.254: v28.45,32.51 28.45,31.75 28.7,31.5 28.7,26.85 28.4,26.54 26.54,26.54 v25.91,25.91
N$17
  Top 0.254: LED3.A 25.4,20.33 24.13,19.06 24.13,17.95 R16.1
N$18
  Top 0.254: LED6.A 31.5,21.86 31.75,21.6 31.75,16.76 30.48,15.49 R29.1
N$19
  Top 0.508: D3.A 5.08,23.18 PTC1.1
N$25  (via drill 0.3)
  Top 0.508: R14.2 R28.2 R29.2 R13.2 | R15.2 R16.2 R13.2 | JP4.1 8.83,18.48 8.38,18.03 7.87,18.03 7.62,17.78 7.62,16.76 10.67,13.72 v15.24,13.72 | R34.2 24.3,13.72 v24.64,13.72 24.98,13.72 R13.2
  Bottom 0.508: v15.24,13.72 v24.64,13.72
OC_ALERT  (via drill 0.3)
  Top 0.254: R23.2 v25.65,40.13 27.26,40.13 Q8.1 | U2.9 12.81,34.91 v12.7,34.8 12.7,33.53 13.72,32.51 13.72,28.19 13.21,27.69 v13.21,26.92 13.66,26.47 U3.7
  Bottom 0.254: v25.65,40.13 23.11,37.59 23.11,34.54 22.35,33.78 13.21,33.78 12.7,34.29 v12.7,34.8 | v13.21,26.92 13.21,25.65 12.7,25.15 12.7,13.46 15.24,10.92 17.02,10.92 J2.12
PGND
  Top 0.508: C3.2 C1.2 5.93,28.36 U1.1 6.88,29.24 8.24,29.24 C4.2 C2.2 L4.1
SC_ALERT  (via drill 0.3)
  Top 0.254: v12.7,36.32 12.81,36.21 U2.7 | R22.2 v25.65,38.61 26.42,39.37 28.19,39.37 28.45,39.12 28.45,38.61 28.96,38.1 29.97,38.1 30.48,37.59 30.48,37.08 31.43,36.13 Q9.1 | U3.8 13.04,25.82 v12.45,26.42 12.45,27.69 13.21,28.45 13.21,32.26 v11.94,33.53
  Bottom 0.254: v12.7,36.32 11.94,35.56 v11.94,33.53 12.19,33.27 22.61,33.27 23.62,34.29 23.62,36.58 v25.65,38.61 | J2.10 12.19,13.21 12.19,25.4 12.45,25.65 v12.45,26.42
SCL
  Top 0.254: J2.9 19.05,3.81 19.05,13.55 R20.1 17.11,16.34 Q2.3
SCL_3V3
  Top 0.254: U2.19 20.75,36.21 21.34,35.63 21.34,35.05 21.08,34.8 21.08,25.91 20.07,24.89 19.05,24.89 18.03,23.88 | Q2.2 15.41,19.39 R18.1 16.42,22.1 17.27,22.1 18.03,22.86 18.03,23.88 | U3.12 17.49,24.43 18.03,23.88
SDA
  Top 0.254: J2.11 21.59,3.81 21.59,14.57 R19.1 20.66,16.34 Q1.3
SDA_3V3  (via drill 0.3)
  Top 0.254: v20.29,36.86 U2.20 | R17.1 18.96,20.83 | 18.96,20.83 18.96,19.39 Q1.2 | v19.05,22.35 19.05,20.92 18.96,20.83 | v20.57,35.31 20.57,26.16 20.07,25.65 v19.81,25.65 19.3,25.65 19.14,25.82 U3.13
  Bottom 0.254: v20.29,36.86 20.57,36.58 v20.57,35.31 | v19.81,25.65 19.81,24.89 19.56,24.64 19.56,22.86 v19.05,22.35
TH+  (via drill 1.5 pad 2.54)
  other vias: 19.05,51.82
  pour Top (no thermals): 23.37,48.26 23.37,45.72 20.83,45.72 20.32,46.23 20.32,48.51 17.53,51.31 17.53,52.32 19.3,54.1 24.13,54.1 24.89,53.34 24.89,49.78
TH-  (via drill 1.5 pad 2.54)
  other vias: 13.97,51.82
  pour Top (no thermals): 9.65,45.72 12.19,45.72 12.7,46.23 12.7,48.51 15.49,51.31 15.49,52.58 13.97,54.1 9.14,54.1 8.13,53.09 8.13,49.78 9.65,48.26
VIN+
  Top 0.4: U2.2 17.16,39.93
  pour Top (no thermals): 17.27,38.61 17.78,39.12 19.3,39.12 19.81,39.62 19.81,40.64 19.3,41.15 18.8,41.15 18.29,41.66 18.29,42.42 18.03,42.67 17.02,42.67 16.76,42.42 16.76,38.86 17.02,38.61
VIN-
  Top 0.4: U2.4 15.86,39.93
  pour Top (no thermals): 16,38.61 16.26,38.86 16.26,42.42 16,42.67 14.99,42.67 14.73,42.42 14.73,41.66 14.22,41.15 13.72,41.15 13.21,40.64 13.21,39.62 13.72,39.12 15.24,39.12 15.75,38.61

### Text on the board
tPlace: Thermocouple / Input | Type (K J T N S E B R) | T- | T+ | ADDR | GND | 3V3 | A2 | A1 | A0 | LED | PWR / 04 / 03 / 02 / 01 / SC / OC | 04 / 03 / 02 / 01 / SC / OC | GND / 5V / 3V3 / INT / SCL / SDA | v1.0 | I2C Themocouple Amplifier / (MCP960X/ / L0X/RL0X)
bPlace: T- | T+ | Thermocouple / Input | Type (K J T N S E B R) | I2C Themocouple Amplifier / (MCP960X/L0X/RL0X) | OC / SC / 01 / 02 / 03 / 04 | v1.0 | SDA / SCL / INT / 3V3 / 5V / GND
tDocu: OldGerman | Date: 2020/11/24